# Altium schematic sheet 1 - Top.SchDoc
size A4 portrait
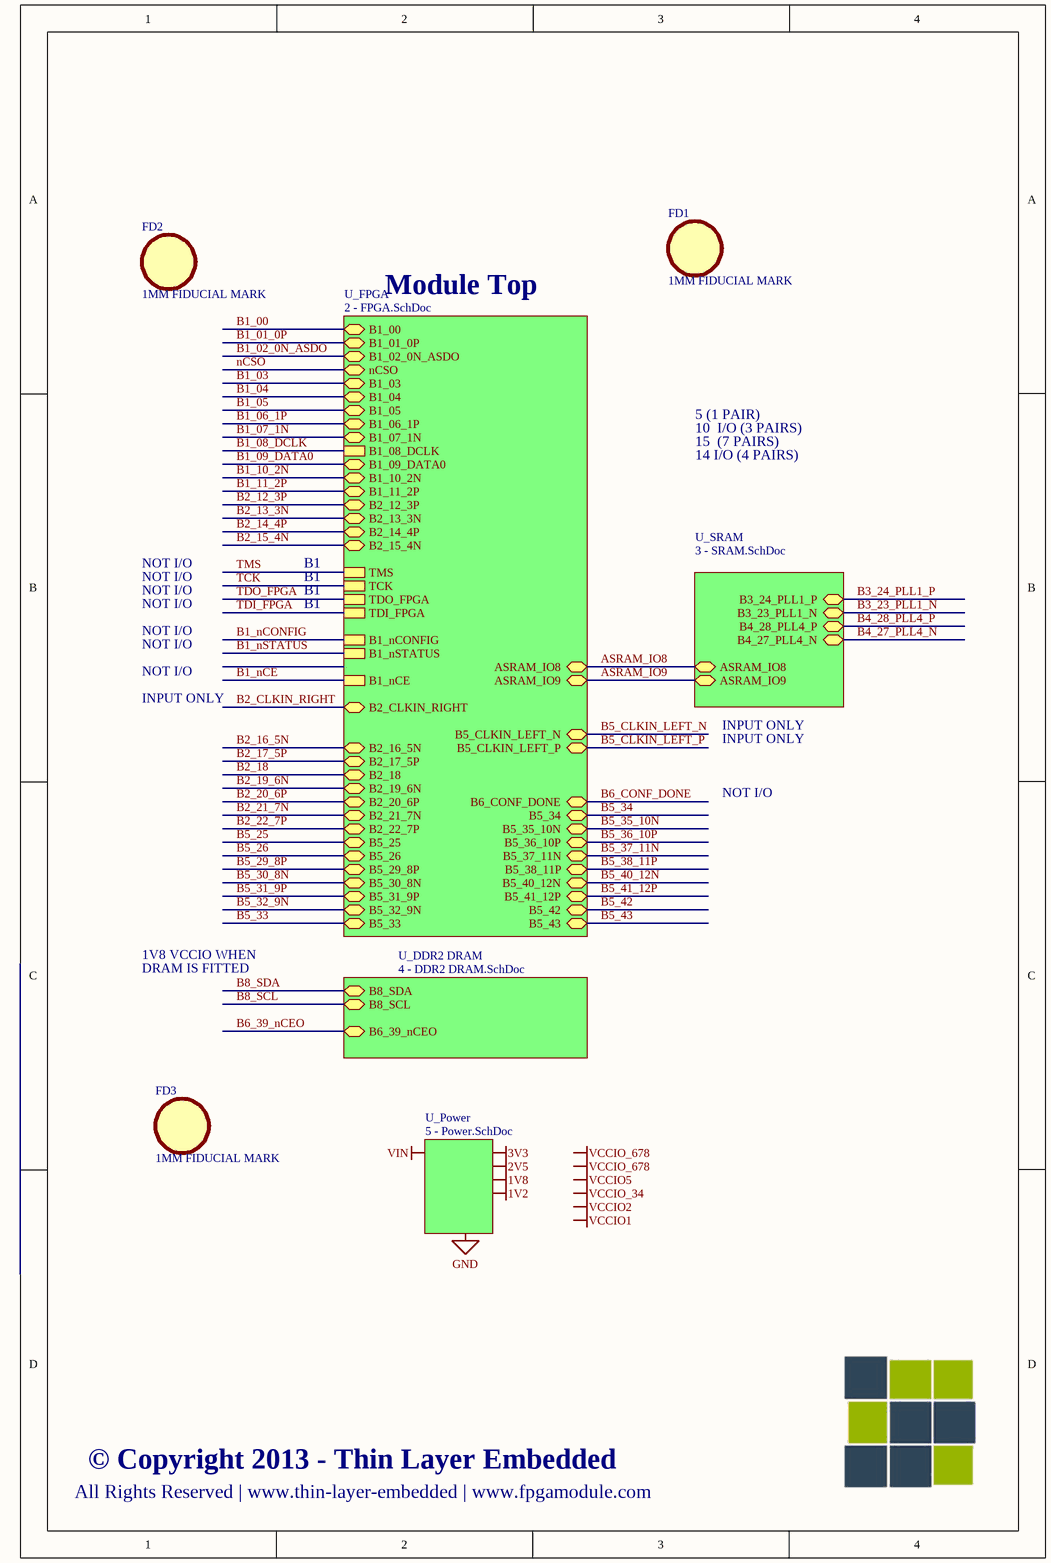
[diagram p0: 1 - Top.SchDoc]

## Parts
FD1  1MM FIDUCIAL MARK  [FID_1MM]
FD2  1MM FIDUCIAL MARK  [FID_1MM]
FD3  1MM FIDUCIAL MARK  [FID_1MM]

## Sub-sheets
U_DDR2 DRAM = 4 - DDR2 DRAM.SchDoc: B6_39_nCEO, B8_SDA, B8_SCL
U_FPGA = 2 - FPGA.SchDoc: TMS, TCK, TDO_FPGA, TDI_FPGA, B1_nCONFIG, B1_08_DCLK, B1_nCE, B2_CLKIN_RIGHT, B5_CLKIN_LEFT_N, ASRAM_IO8, B1_00, B1_04, nCSO, B1_09_DATA0, B1_01_0P, B1_02_0N_ASDO, B1_03, B1_07_1N, B1_05, B1_06_1P, B1_11_2P, B1_10_2N, B2_12_3P, B2_15_4N, B2_13_3N, B2_14_4P, B2_17_5P, B2_16_5N, B2_20_6P, B2_19_6N, B2_18, B2_21_7N, B2_22_7P, B5_32_9N, B5_29_8P, B5_35_10N, B5_41_12P, B5_31_9P, B5_30_8N, B5_34, B5_33, B5_36_10P, B5_37_11N, B5_38_11P, B5_40_12N, B5_43, B5_42, B6_CONF_DONE, B1_nSTATUS, B5_CLKIN_LEFT_P, B5_25, B5_26, ASRAM_IO9
U_Power = 5 - Power.SchDoc: no entries
U_SRAM = 3 - SRAM.SchDoc: B4_27_PLL4_N, B4_28_PLL4_P, B3_23_PLL1_N, B3_24_PLL1_P, ASRAM_IO8, ASRAM_IO9

## Nets
ASRAM_IO8: sheet U_FPGA/ASRAM_IO8, sheet U_SRAM/ASRAM_IO8
ASRAM_IO9: sheet U_FPGA/ASRAM_IO9, sheet U_SRAM/ASRAM_IO9
B1_00: sheet U_FPGA/B1_00
B1_01_0P: sheet U_FPGA/B1_01_0P
B1_02_0N_ASDO: sheet U_FPGA/B1_02_0N_ASDO
B1_03: sheet U_FPGA/B1_03
B1_04: sheet U_FPGA/B1_04
B1_05: sheet U_FPGA/B1_05
B1_06_1P: sheet U_FPGA/B1_06_1P
B1_07_1N: sheet U_FPGA/B1_07_1N
B1_08_DCLK: sheet U_FPGA/B1_08_DCLK
B1_09_DATA0: sheet U_FPGA/B1_09_DATA0
B1_10_2N: sheet U_FPGA/B1_10_2N
B1_11_2P: sheet U_FPGA/B1_11_2P
B1_nCE: sheet U_FPGA/B1_nCE
B1_nCONFIG: sheet U_FPGA/B1_nCONFIG
B1_nSTATUS: sheet U_FPGA/B1_nSTATUS
B2_12_3P: sheet U_FPGA/B2_12_3P
B2_13_3N: sheet U_FPGA/B2_13_3N
B2_14_4P: sheet U_FPGA/B2_14_4P
B2_15_4N: sheet U_FPGA/B2_15_4N
B2_16_5N: sheet U_FPGA/B2_16_5N
B2_17_5P: sheet U_FPGA/B2_17_5P
B2_18: sheet U_FPGA/B2_18
B2_19_6N: sheet U_FPGA/B2_19_6N
B2_20_6P: sheet U_FPGA/B2_20_6P
B2_21_7N: sheet U_FPGA/B2_21_7N
B2_22_7P: sheet U_FPGA/B2_22_7P
B2_CLKIN_RIGHT: sheet U_FPGA/B2_CLKIN_RIGHT
B3_23_PLL1_N: sheet U_SRAM/B3_23_PLL1_N
B3_24_PLL1_P: sheet U_SRAM/B3_24_PLL1_P
B4_27_PLL4_N: sheet U_SRAM/B4_27_PLL4_N
B4_28_PLL4_P: sheet U_SRAM/B4_28_PLL4_P
B5_25: sheet U_FPGA/B5_25
B5_26: sheet U_FPGA/B5_26
B5_29_8P: sheet U_FPGA/B5_29_8P
B5_30_8N: sheet U_FPGA/B5_30_8N
B5_31_9P: sheet U_FPGA/B5_31_9P
B5_32_9N: sheet U_FPGA/B5_32_9N
B5_33: sheet U_FPGA/B5_33
B5_34: sheet U_FPGA/B5_34
B5_35_10N: sheet U_FPGA/B5_35_10N
B5_36_10P: sheet U_FPGA/B5_36_10P
B5_37_11N: sheet U_FPGA/B5_37_11N
B5_38_11P: sheet U_FPGA/B5_38_11P
B5_40_12N: sheet U_FPGA/B5_40_12N
B5_41_12P: sheet U_FPGA/B5_41_12P
B5_42: sheet U_FPGA/B5_42
B5_43: sheet U_FPGA/B5_43
B5_CLKIN_LEFT_N: sheet U_FPGA/B5_CLKIN_LEFT_N
B5_CLKIN_LEFT_P: sheet U_FPGA/B5_CLKIN_LEFT_P
B6_39_nCEO: sheet U_DDR2 DRAM/B6_39_nCEO
B6_CONF_DONE: sheet U_FPGA/B6_CONF_DONE
B8_SCL: sheet U_DDR2 DRAM/B8_SCL
B8_SDA: sheet U_DDR2 DRAM/B8_SDA
nCSO: sheet U_FPGA/nCSO
TCK: sheet U_FPGA/TCK
TDI_FPGA: sheet U_FPGA/TDI_FPGA
TDO_FPGA: sheet U_FPGA/TDO_FPGA
TMS: sheet U_FPGA/TMS

Not connected (* = marked no-connect by the designer): FD1 1(FID); FD2 1(FID); FD3 1(FID)

## Notes on the sheet
- Module Top
- 10  I/O (3 PAIRS)
- 5 (1 PAIR)
- 15  (7 PAIRS)
- 14 I/O (4 PAIRS)
- NOT I/O
- B1
- INPUT ONLY
- 1V8 VCCIO WHEN
- DRAM IS FITTED
- All Rights Reserved | www.thin-layer-embedded | www.fpgamodule.com
- © Copyright 2013 - Thin Layer Embedded
- Labels drawn without touching a wire or pin: 1V2, 1V8, 2V5, 3V3, GND, VCCIO1, VCCIO2, VCCIO5, VCCIO_34, VCCIO_678, VIN

## Library data of the parts
FD1-FD3 = FID